# Altium schematic sheet Watchdog_Reset.SchDoc: FPGA Motherboard for Digital Multiplexed Readout, McGill U.
size A; DocumentNumber: DfMUX16; Revision: Rev0, Prototype; SheetNumber: 16; SheetTotal: 27; PageSetup: Record=PageOptions|CenterHorizontal=True|CenterVertical=True|PrintScale=0.73|XCorrection=1.00|YCorrection=1.00|PrintKind=0|BorderSize=5000000|LeftOffset=0|BottomOffset=0|Orientation=2|PaperLength=1000|PaperWidth=1000|Scale=100|PaperSource=7|PrintQuality=-4|MediaType=1|DitherType=10|PaperKind=Letter|PrintScaleMode=1
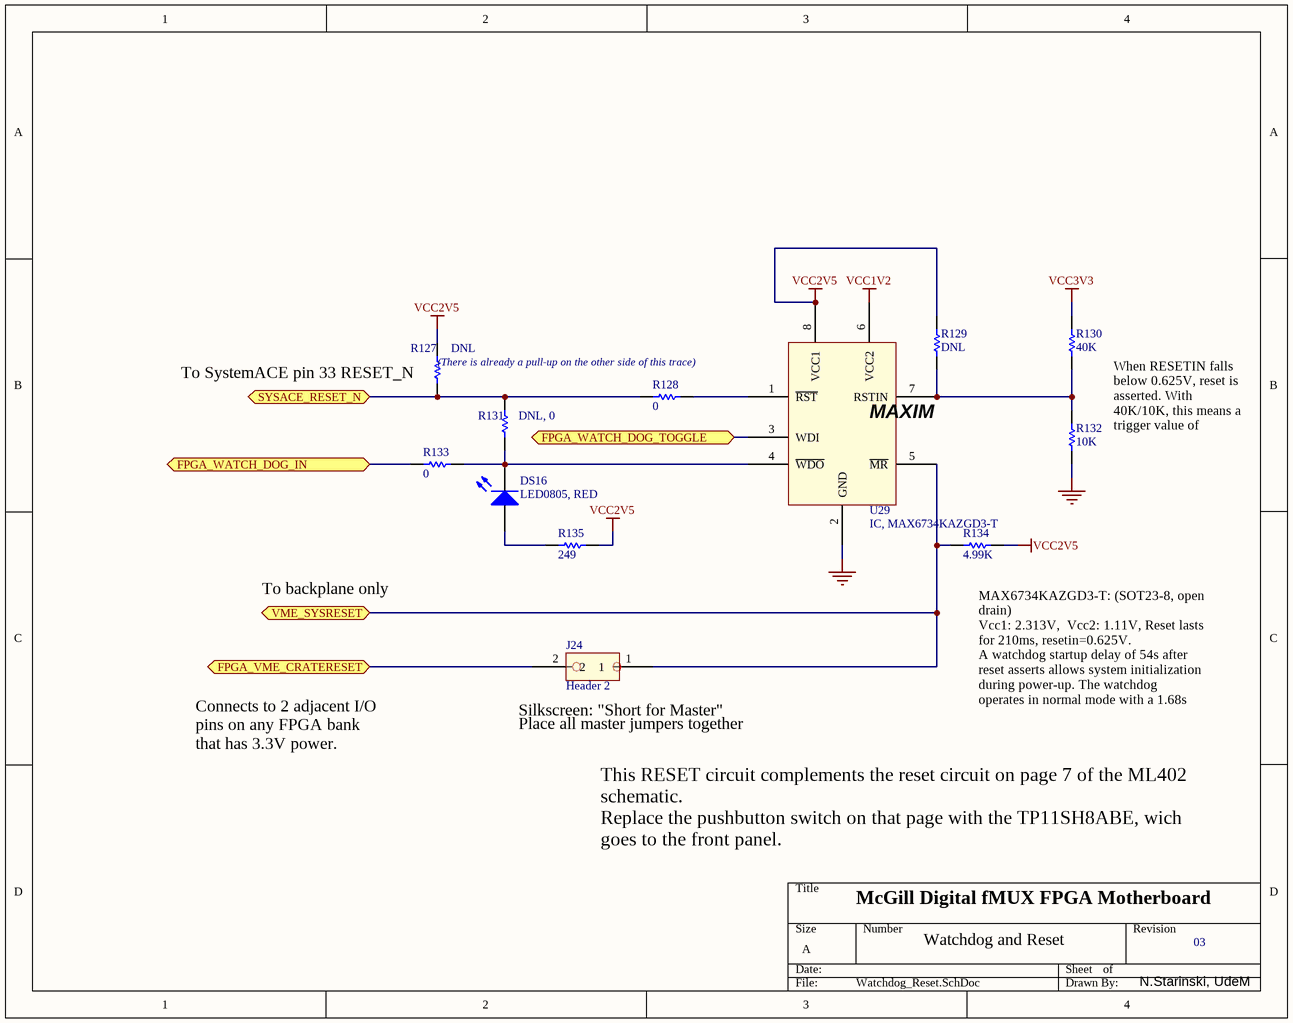
[diagram p0: Watchdog_Reset.SchDoc]

## Parts
DS16  LED0805, RED  [SMD _LED]
J24  Header 2  [HDR1X2]
R127  DNL  [CR1608-0603]
R128  0  [CR1608-0603]
R129  DNL  [CR1608-0603]
R130  40K  [CR1608-0603]
R131  DNL, 0  [CR1608-0603]
R132  10K  [CR1608-0603]
R133  0  [CR1608-0603]
R134  4.99K  [CR1608-0603]
R135  249  [CR1608-0603]
U29  IC, MAX6734KAZGD3-T  [SOP23-8]

## Ports
FPGA_VME_CRATERESET (bidir), FPGA_WATCH_DOG_IN (bidir), FPGA_WATCH_DOG_TOGGLE (bidir), SYSACE_RESET_N (bidir), VME_SYSRESET (bidir)

## Nets
GND: R132.1 U29.2(GND)
VCC1V2: U29.6(VCC2)
VCC2V5: R127.2 R129.2 R134.2 R135.2 U29.8(VCC1)
VCC3V3: R130.2
FPGA_VME_CRATERESET: J24.2 ; port FPGA_VME_CRATERESET
FPGA_WATCH_DOG_IN: R133.1 ; port FPGA_WATCH_DOG_IN
FPGA_WATCH_DOG_TOGGLE: U29.3(WDI) ; port FPGA_WATCH_DOG_TOGGLE
SYSACE_RESET_N: R127.1 R128.1 R131.2 ; port SYSACE_RESET_N
VME_SYSRESET: J24.1 R134.1 U29.5(~{MR}) ; port VME_SYSRESET
NetDS16_1: DS16.1(A) R135.1
NetDS16_2: DS16.2(K) R131.1 R133.2 U29.4(~{WDO})
NetR128_2: R128.2 U29.1(~{RST})
NetR129_1: R129.1 R130.1 R132.2 U29.7(RSTIN)

## Notes on the sheet
- (near R127) (There is already a pull-up on the other side of this trace)
- (near R127) To SystemACE pin 33 RESET_N
- When RESETIN falls below 0.625V, reset is asserted. With 40K/10K, this means a trigger value of 3.125V.
- To backplane only
- (near R134) MAX6734KAZGD3-T: (SOT23-8, open drain)
  Vcc1: 2.313V,  Vcc2: 1.11V, Reset lasts for 210ms, resetin=0.625V.
  A watchdog startup delay of 54s after reset asserts allows system initialization during power-up. The watchdog operates in normal mode with a 1.68s delay after initialization.
- Connects to 2 adjacent I/O pins on any FPGA bank that has 3.3V power.
- (near J24) Silkscreen: "Short for Master"
- (near J24) Place all master jumpers together
- This RESET circuit complements the reset circuit on page 7 of the ML402 schematic.
  Replace the pushbutton switch on that page with the TP11SH8ABE, wich goes to the front panel.
- McGill Digital fMUX FPGA Motherboard
- Watchdog and Reset
- 03
- N.Starinski, UdeM
- (in symbol MAX6734) MAXIM

## Library data of the parts
DS16 = LED3: LED 0805 LTST-C170CKT; Published: 8-Jun-2000; LatestRevisionDate: 17-Dec-2003; LatestRevisionNote: PCB Footprint replaced.; Publisher: Altium Limited
J24 = Jumper_100mil: Header, 0.1" 2-Pin straight
R127 R129 = Res Semi: Semiconductor Resistor; Published: 8-Jun-2000; LatestRevisionDate: 17-Jul-2002; LatestRevisionNote: Re-released for DXP Platform.; Publisher: Altium Limited
R128 R130-R135 = Res Semi: Resistor 0603; Published: 8-Jun-2000; LatestRevisionDate: 17-Jul-2002; LatestRevisionNote: Re-released for DXP Platform.; Publisher: Altium Limited
U29 = MAX6734: uP Supervisory Circuit